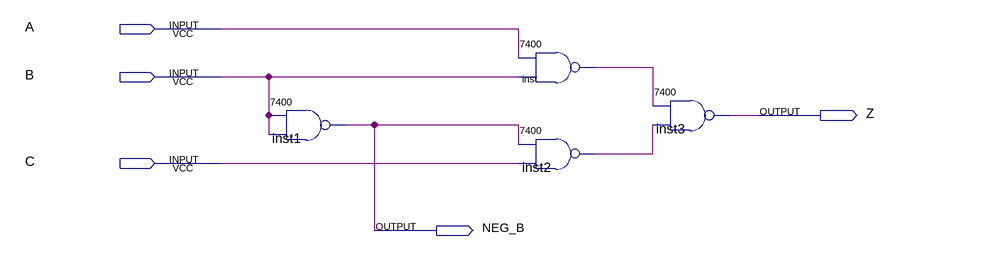
[diagram p0: schematic sheet]
// Quartus schematic Block1.bdf as structural Verilog: 4 symbols, 5 pins
module Block1 (
  input  A,
  input  B,
  input  C,
  output Z,
  output NEG_B
);

  wire inst2_1, inst_1;

  \7400  inst1 (.\3 (B), .\2 (B), .\1 (NEG_B));
  \7400  inst (.\3 (B), .\2 (A), .\1 (inst_1));
  \7400  inst2 (.\3 (C), .\2 (NEG_B), .\1 (inst2_1));
  \7400  inst3 (.\3 (inst2_1), .\2 (inst_1), .\1 (Z));
endmodule
